# Altium schematic sheet Comparator.SchDoc
size A4; CompanyName: WEITI ISE; Address1: ul. Nowowiejska 15/19; Address2: 00-665 Warszawa; DocumentNumber: 2; SheetNumber: 2; SheetTotal: 11
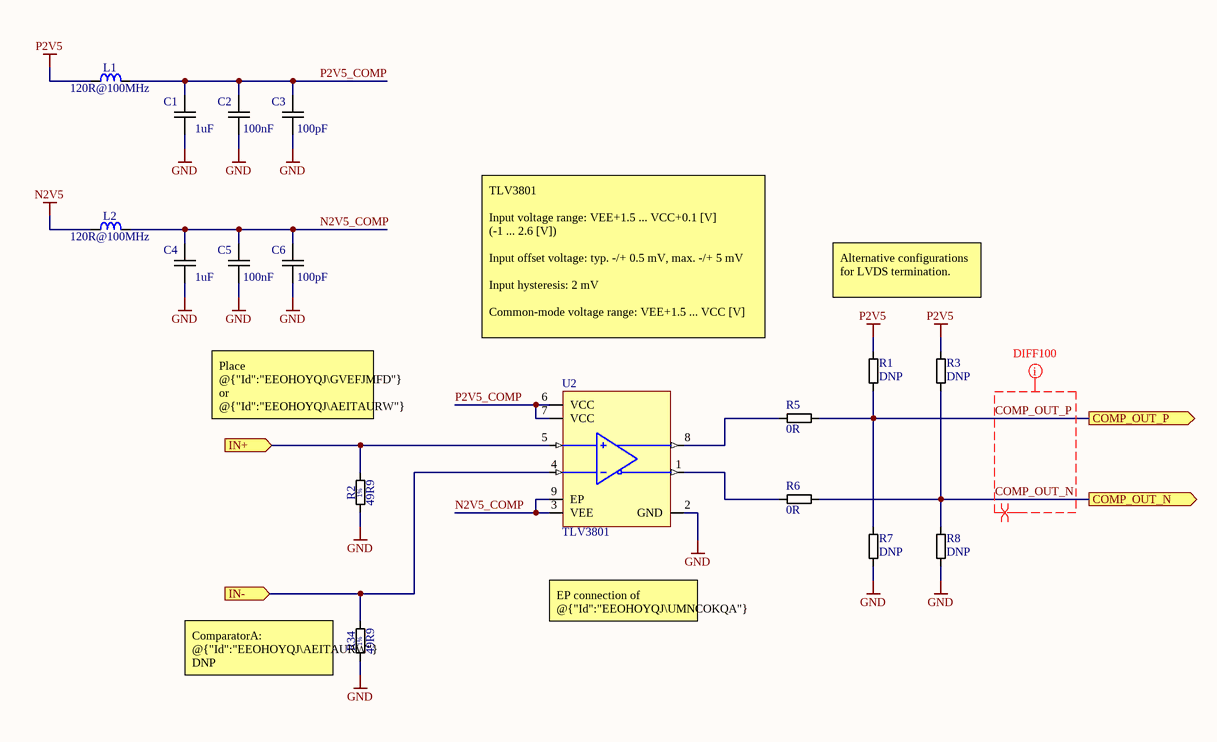
[diagram p0: Comparator.SchDoc]

## Parts
C1  1uF  [CAPC0603X90N]
C2  100nF  [CAPC0603X90N]
C3  100pF  [CAPC0603X90N]
C4  1uF  [CAPC0603X90N]
C5  100nF  [CAPC0603X90N]
C6  100pF  [CAPC0603X90N]
L1  120R@100MHz  [INDC0603X90N]
L2  120R@100MHz  [INDC0603X90N]
R1  DNP  [RESC0402X40N]
R2  49R9  [RESC0402X40N]
R3  DNP  [RESC0402X40N]
R5  0R  [RESC0402X40N]
R6  0R  [RESC0402X40N]
R7  DNP  [RESC0402X40N]
R8  DNP  [RESC0402X40N]
R34  49R9  [RESC0402X40N]
U2  TLV3801  [WSON50P200X200X80-9N]

## Ports
COMP_OUT_N (out), COMP_OUT_P (out), IN+ (in), IN- (in)

## Nets
GND: C1.2 C2.2 C3.2 C4.2 C5.2 C6.2 R2.1 R7.1 R8.1 R34.1 U2.2(GND)
N2V5: L2.1
P2V5: L1.1 R1.2 R3.2
COMP_OUT_N: R3.1 R6.2 R8.2 ; port COMP_OUT_N
COMP_OUT_P: R1.1 R5.2 R7.2 ; port COMP_OUT_P
IN+: R2.2 U2.5(IN+) ; port IN+
IN-: R34.2 U2.4(IN-) ; port IN-
N2V5_COMP: C4.1 C5.1 C6.1 L2.2 U2.3(VEE) U2.9(EP)
P2V5_COMP: C1.1 C2.1 C3.1 L1.2 U2.6(VCC) U2.7(VCC)
NetR5_1: R5.1 U2.8(OUT+)
NetR6_1: R6.1 U2.1(OUT-)

## Layout directives
mark named DIFF100: COMP_OUT_N, COMP_OUT_P
differential pair; differential pair class DIFF100_LINES; net class DIFF100: COMP_OUT_N, COMP_OUT_P

## Notes on the sheet
- TLV3801
  Input voltage range: VEE+1.5 ... VCC+0.1 [V]
  (-1 ... 2.6 [V])
  Input offset voltage: typ. -/+ 0.5 mV, max. -/+ 5 mV
  Input hysteresis: 2 mV
  Common-mode voltage range: VEE+1.5 ... VCC [V]
- Alternative configurations for LVDS termination.
- Place @{"Id":"EEOHOYQJ\GVEFJMFD"} or @{"Id":"EEOHOYQJ\AEITAURW"} resistors as close as possible to the input pin of TLV3801
- (near R34) ComparatorA: @{"Id":"EEOHOYQJ\AEITAURW"} DNP
  ComparatorB: @{"Id":"EEOHOYQJ\GVEFJMFD"} DNP
- EP connection of @{"Id":"EEOHOYQJ\UMNCOKQA"} verified with TI support.
- Project:
- Title
- File:
- Drawn by:
- Engineer:
- Checked by:
- Szymon Jedliński
- Sheet:
- Revision:
- Total Sheet:
- 1.0
- Variant:
- Approved by:
- Date:

## Library data of the parts
C1 C4 = CC0603_1UF_16V_10%_X7R: Non-polarised capacitor; Manufacturer Part Number: CL10B105KO8NNNC; DesignItemId: CC0603_1UF_16V_10%_X7R; HelpURL: https://www.mouser.pl/datasheet/2/585/MLCC-1837944.pdf; Height: 0.8mm; SMD: Yes; Value: 1uF
C2 C5 = CC0603_100NF_16V_10%_X7R: Non-polarised capacitor; Manufacturer Part Number: VJ0603Y104KXJCW1BC; DesignItemId: CC0603_100NF_16V_10%_X7R; HelpURL: https://www.vishay.com/docs/28548/vjw1bcbascomseries.pdf; Height: 0.8mm; SMD: Yes; Value: 100nF
C3 C6 = CC0603_100PF_50V_5%_X7R: Non-polarised capacitor; Manufacturer Part Number: 06035C101JAT2A; DesignItemId: CC0603_100PF_50V_5%_X7R; HelpURL: https://www.mouser.pl/datasheet/2/40/KGM_X7R-3223212.pdf; Height: 0.8mm; SMD: Yes; Value: 100pF
L1 L2 = FB0603_120R@100MHZ_2A: Ferrite Bead; Manufacturer Part Number: BLM18PG121SN1D; Manufacturer 1 Component Height: 0.8mm; Tolerance: 25%; DesignItemId: FB0603_120R@100MHZ_2A; HelpURL: https://www.tme.eu/Document/19a35c43258593752611d1c31a7dbf1a/MURATA-BLM18P.pdf; SMD: Yes; Value: 120R@100MHz
R1 R3 R7 R8 = R0402_DNP: General Purpose Thick Film Chip Resistor; Manufacturer 1 Component Height: 0.4mm; Voltage: 50V; DesignItemId: R0402_DNP; HelpURL: https://www.vishay.com/docs/20035/dcrcwe3.pdf; SMD: Yes; Value: DNP
R2 R34 = R0402_49R9_0.0625W_100PPM: General Purpose Thick Film Chip Resistor; Manufacturer Part Number: RC0402FR-0749R9L; Manufacturer 1 Component Height: 0.4mm; Tolerance: 1%; Voltage: 50V; DesignItemId: R0402_49R9_0.0625W_100PPM; HelpURL: https://www.mouser.pl/datasheet/2/447/PYu_RC_Group_51_RoHS_L_11-1984063.pdf; SMD: Yes; Value: 49R9
R5 R6 = R0402_0R_JUMPER: General Purpose Thick Film Chip Resistor; Manufacturer Part Number: CRCW04020000Z0EDC; Manufacturer 1 Component Height: 0.4mm; Tolerance: 20mOhm; Voltage: 50V; DesignItemId: R0402_0R_JUMPER; HelpURL: https://www.vishay.com/docs/20035/dcrcwe3.pdf; SMD: Yes; Value: 0R
U2 = TLV3801: 225-ps High-Speed Comparator with LVDS Outputs; Manufacturer Part Number: TLV3801DSG(_); Manufacturer 1 Component Height: 0.8mm; Supplier 1: Mouser; Supplier Part Number 1: 595-TLV3801DSGR; Supplier 2: Mouser; Supplier Part Number 2: 595-TLV3801DSGT; DesignItemId: TLV3801; Device: TLV3801; HelpURL: https://www.ti.com/lit/ds/symlink/tlv3801.pdf?ts=1690237794912; SMD: Yes